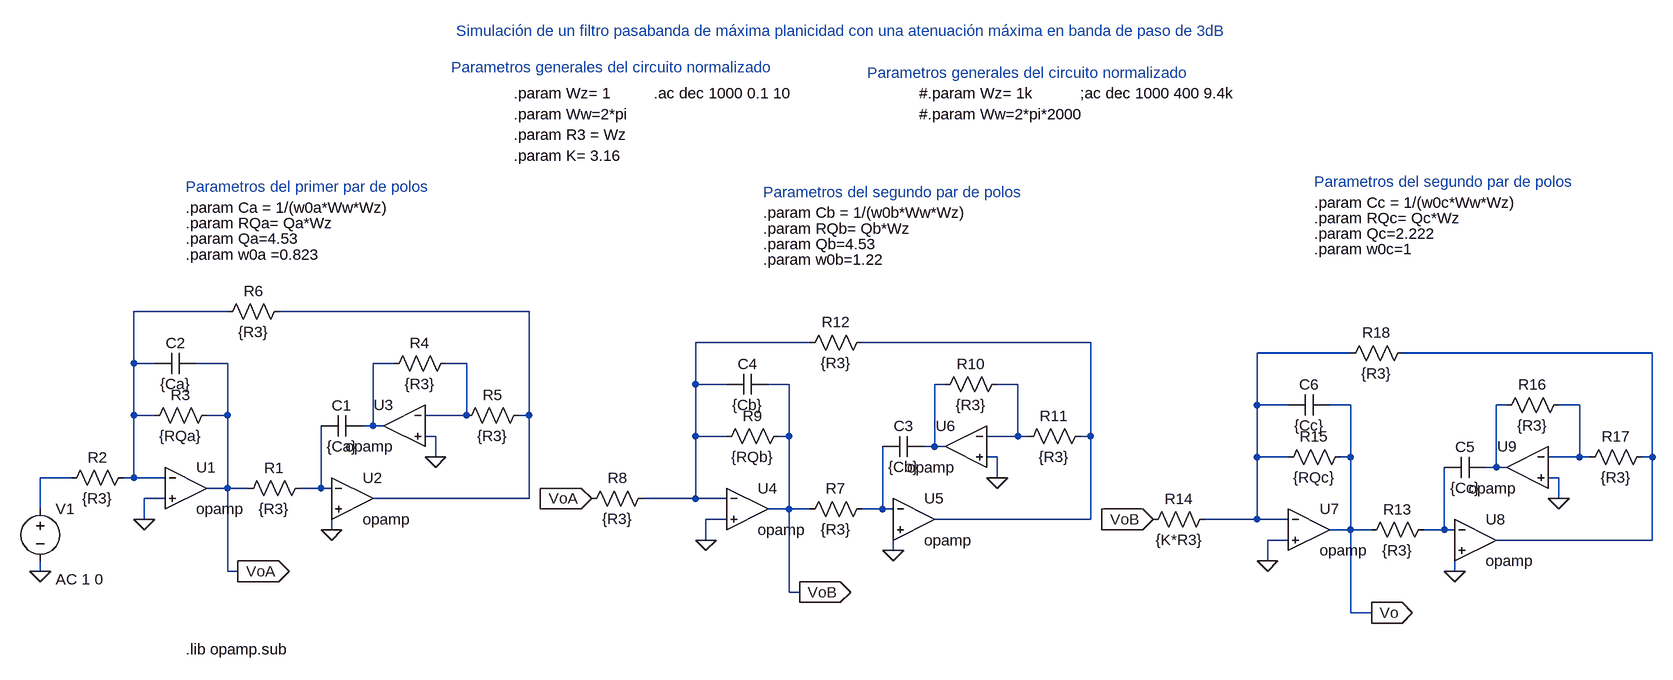
[diagram p0: schematic sim_ts4Bis.asc]
sim_ts4Bis.asc, the LTspice schematic file:
Version 4
SHEET 1 1736 856
WIRE -688 -128 -832 -128
WIRE -224 -128 -608 -128
WIRE 208 -80 32 -80
WIRE 640 -80 288 -80
WIRE 1040 -64 896 -64
WIRE 1504 -64 1120 -64
WIRE -832 -48 -832 -128
WIRE -800 -48 -832 -48
WIRE -688 -48 -736 -48
WIRE -432 -48 -464 -48
WIRE -320 -48 -352 -48
WIRE 32 -16 32 -80
WIRE 80 -16 32 -16
WIRE 176 -16 144 -16
WIRE 416 -16 400 -16
WIRE 528 -16 496 -16
WIRE 896 16 896 -64
WIRE 944 16 896 16
WIRE 1040 16 1008 16
WIRE 1280 16 1264 16
WIRE 1392 16 1360 16
WIRE -832 32 -832 -48
WIRE -800 32 -832 32
WIRE -688 32 -688 -48
WIRE -688 32 -720 32
WIRE -320 32 -320 -48
WIRE -320 32 -384 32
WIRE -224 32 -224 -128
WIRE -224 32 -240 32
WIRE -464 48 -464 -48
WIRE -464 48 -480 48
WIRE -448 48 -464 48
WIRE -368 64 -384 64
WIRE 32 64 32 -16
WIRE 80 64 32 64
WIRE 176 64 176 -16
WIRE 176 64 160 64
WIRE 528 64 528 -16
WIRE 528 64 480 64
WIRE 544 64 528 64
WIRE 640 64 640 -80
WIRE 640 64 624 64
WIRE 400 80 400 -16
WIRE 400 80 384 80
WIRE 416 80 400 80
WIRE -368 96 -368 64
WIRE 496 96 480 96
WIRE 896 96 896 16
WIRE 944 96 896 96
WIRE 1040 96 1040 16
WIRE 1040 96 1024 96
WIRE 1392 96 1392 16
WIRE 1392 96 1344 96
WIRE 1408 96 1392 96
WIRE 1504 96 1504 -64
WIRE 1504 96 1488 96
WIRE 1264 112 1264 16
WIRE 1264 112 1248 112
WIRE 1280 112 1264 112
WIRE -928 128 -976 128
WIRE -832 128 -832 32
WIRE -832 128 -848 128
WIRE -784 128 -832 128
WIRE 496 128 496 96
WIRE 1360 128 1344 128
WIRE -688 144 -688 32
WIRE -688 144 -720 144
WIRE -656 144 -688 144
WIRE -544 144 -544 48
WIRE -544 144 -576 144
WIRE -528 144 -544 144
WIRE -784 160 -816 160
WIRE -224 160 -224 32
WIRE -224 160 -464 160
WIRE 32 160 32 64
WIRE 32 160 -48 160
WIRE 80 160 32 160
WIRE 1360 160 1360 128
WIRE -976 176 -976 128
WIRE 176 176 176 64
WIRE 176 176 144 176
WIRE 208 176 176 176
WIRE 320 176 320 80
WIRE 320 176 288 176
WIRE 336 176 320 176
WIRE -816 192 -816 160
WIRE 80 192 48 192
WIRE 640 192 640 64
WIRE 640 192 400 192
WIRE 896 192 896 96
WIRE 896 192 816 192
WIRE 944 192 896 192
WIRE -528 208 -528 176
WIRE 1040 208 1040 96
WIRE 1040 208 1008 208
WIRE 1072 208 1040 208
WIRE 1184 208 1184 112
WIRE 1184 208 1152 208
WIRE 1200 208 1184 208
WIRE 48 224 48 192
WIRE 944 224 912 224
WIRE 1504 224 1504 96
WIRE 1504 224 1264 224
WIRE 336 240 336 208
WIRE 912 256 912 224
WIRE -976 272 -976 256
WIRE -688 272 -688 144
WIRE -672 272 -688 272
WIRE 1200 272 1200 240
WIRE 176 304 176 176
WIRE 192 304 176 304
WIRE 1040 336 1040 208
WIRE 1072 336 1040 336
FLAG -672 272 VoA
IOPIN -672 272 Out
FLAG -976 272 0
FLAG -816 192 0
FLAG -528 208 0
FLAG -368 96 0
FLAG 192 304 VoB
IOPIN 192 304 Out
FLAG 48 224 0
FLAG 336 240 0
FLAG 496 128 0
FLAG -128 160 VoA
IOPIN -128 160 In
FLAG 1072 336 Vo
IOPIN 1072 336 Out
FLAG 912 256 0
FLAG 1200 272 0
FLAG 1360 160 0
FLAG 736 192 VoB
IOPIN 736 192 In
SYMBOL OpAmps\\opamp -752 80 R0
SYMATTR InstName U1
SYMBOL OpAmps\\opamp -496 96 R0
SYMATTR InstName U2
SYMBOL OpAmps\\opamp -416 -16 M0
SYMATTR InstName U3
SYMBOL res -560 128 R90
WINDOW 0 0 56 VBottom 2
WINDOW 3 32 56 VTop 2
SYMATTR InstName R1
SYMATTR Value {R3}
SYMBOL res -832 112 R90
WINDOW 0 0 56 VBottom 2
WINDOW 3 32 56 VTop 2
SYMATTR InstName R2
SYMATTR Value {R3}
SYMBOL res -704 16 R90
WINDOW 0 0 56 VBottom 2
WINDOW 3 32 56 VTop 2
SYMATTR InstName R3
SYMATTR Value {RQa}
SYMBOL cap -480 32 R90
WINDOW 0 0 32 VBottom 2
WINDOW 3 32 32 VTop 2
SYMATTR InstName C1
SYMATTR Value {Ca}
SYMBOL res -336 -64 R90
WINDOW 0 0 56 VBottom 2
WINDOW 3 32 56 VTop 2
SYMATTR InstName R4
SYMATTR Value {R3}
SYMBOL res -224 16 R90
WINDOW 0 0 56 VBottom 2
WINDOW 3 32 56 VTop 2
SYMATTR InstName R5
SYMATTR Value {R3}
SYMBOL res -592 -144 R90
WINDOW 0 0 56 VBottom 2
WINDOW 3 32 56 VTop 2
SYMATTR InstName R6
SYMATTR Value {R3}
SYMBOL voltage -976 160 R0
WINDOW 123 24 124 Left 2
WINDOW 39 0 0 Left 2
SYMATTR Value2 AC 1 0
SYMATTR InstName V1
SYMATTR Value ""
SYMBOL cap -736 -64 R90
WINDOW 0 0 32 VBottom 2
WINDOW 3 32 32 VTop 2
SYMATTR InstName C2
SYMATTR Value {Ca}
SYMBOL OpAmps\\opamp 112 112 R0
SYMATTR InstName U4
SYMBOL OpAmps\\opamp 368 128 R0
SYMATTR InstName U5
SYMBOL OpAmps\\opamp 448 16 M0
SYMATTR InstName U6
SYMBOL res 304 160 R90
WINDOW 0 0 56 VBottom 2
WINDOW 3 32 56 VTop 2
SYMATTR InstName R7
SYMATTR Value {R3}
SYMBOL res -32 144 R90
WINDOW 0 0 56 VBottom 2
WINDOW 3 32 56 VTop 2
SYMATTR InstName R8
SYMATTR Value {R3}
SYMBOL res 176 48 R90
WINDOW 0 0 56 VBottom 2
WINDOW 3 32 56 VTop 2
SYMATTR InstName R9
SYMATTR Value {RQb}
SYMBOL cap 384 64 R90
WINDOW 0 0 32 VBottom 2
WINDOW 3 32 32 VTop 2
SYMATTR InstName C3
SYMATTR Value {Cb}
SYMBOL res 512 -32 R90
WINDOW 0 0 56 VBottom 2
WINDOW 3 32 56 VTop 2
SYMATTR InstName R10
SYMATTR Value {R3}
SYMBOL res 640 48 R90
WINDOW 0 0 56 VBottom 2
WINDOW 3 32 56 VTop 2
SYMATTR InstName R11
SYMATTR Value {R3}
SYMBOL res 304 -96 R90
WINDOW 0 0 56 VBottom 2
WINDOW 3 32 56 VTop 2
SYMATTR InstName R12
SYMATTR Value {R3}
SYMBOL cap 144 -32 R90
WINDOW 0 0 32 VBottom 2
WINDOW 3 32 32 VTop 2
SYMATTR InstName C4
SYMATTR Value {Cb}
SYMBOL OpAmps\\opamp 976 144 R0
SYMATTR InstName U7
SYMBOL OpAmps\\opamp 1232 160 R0
SYMATTR InstName U8
SYMBOL OpAmps\\opamp 1312 48 M0
SYMATTR InstName U9
SYMBOL res 1168 192 R90
WINDOW 0 0 56 VBottom 2
WINDOW 3 32 56 VTop 2
SYMATTR InstName R13
SYMATTR Value {R3}
SYMBOL res 832 176 R90
WINDOW 0 0 56 VBottom 2
WINDOW 3 32 56 VTop 2
SYMATTR InstName R14
SYMATTR Value {K*R3}
SYMBOL res 1040 80 R90
WINDOW 0 0 56 VBottom 2
WINDOW 3 32 56 VTop 2
SYMATTR InstName R15
SYMATTR Value {RQc}
SYMBOL cap 1248 96 R90
WINDOW 0 0 32 VBottom 2
WINDOW 3 32 32 VTop 2
SYMATTR InstName C5
SYMATTR Value {Cc}
SYMBOL res 1376 0 R90
WINDOW 0 0 56 VBottom 2
WINDOW 3 32 56 VTop 2
SYMATTR InstName R16
SYMATTR Value {R3}
SYMBOL res 1504 80 R90
WINDOW 0 0 56 VBottom 2
WINDOW 3 32 56 VTop 2
SYMATTR InstName R17
SYMATTR Value {R3}
SYMBOL res 1136 -80 R90
WINDOW 0 0 56 VBottom 2
WINDOW 3 32 56 VTop 2
SYMATTR InstName R18
SYMATTR Value {R3}
SYMBOL cap 1008 0 R90
WINDOW 0 0 32 VBottom 2
WINDOW 3 32 32 VTop 2
SYMATTR InstName C6
SYMATTR Value {Cc}
TEXT -248 -400 Left 2 !.param R3 = Wz
TEXT -248 -464 Left 2 !.param Wz= 1
TEXT -248 -432 Left 2 !.param Ww=2*pi
TEXT -344 -504 Left 2 ;Parametros generales del circuito normalizado
TEXT -752 -320 Left 2 ;Parametros del primer par de polos
TEXT -752 -288 Left 2 !.param Ca = 1/(w0a*Ww*Wz)
TEXT -752 -264 Left 2 !.param RQa= Qa*Wz
TEXT -752 -240 Left 2 !.param Qa=4.53
TEXT -752 -216 Left 2 !.param w0a =0.823
TEXT 136 -312 Left 2 ;Parametros del segundo par de polos
TEXT 136 -280 Left 2 !.param Cb = 1/(w0b*Ww*Wz)
TEXT 136 -256 Left 2 !.param RQb= Qb*Wz
TEXT 136 -232 Left 2 !.param Qb=4.53
TEXT 136 -208 Left 2 !.param w0b=1.22
TEXT 984 -328 Left 2 ;Parametros del segundo par de polos
TEXT 984 -296 Left 2 !.param Cc = 1/(w0c*Ww*Wz)
TEXT 984 -272 Left 2 !.param RQc= Qc*Wz
TEXT 984 -248 Left 2 !.param Qc=2.222
TEXT 984 -224 Left 2 !.param w0c=1
TEXT -248 -368 Left 2 !.param K= 3.16
TEXT -32 -464 Left 2 !.ac dec 1000 0.1 10
TEXT -752 392 Left 2 !.lib opamp.sub
TEXT -336 -560 Left 2 ;Simulación de un filtro pasabanda de máxima planicidad con una atenuación máxima en banda de paso de 3dB
TEXT 376 -464 Left 2 !#.param Wz= 1k
TEXT 376 -432 Left 2 !#.param Ww=2*pi*2000
TEXT 296 -496 Left 2 ;Parametros generales del circuito normalizado
TEXT 624 -464 Left 2 !;ac dec 1000 400 9.4k

The netlist it stands for:
* sim_ts4Bis.asc
XU1 N001 0 VoA opamp Aol=100K GBW=10Meg  ; pins invin noninvin out
XU2 N014 0 N002 opamp Aol=100K GBW=10Meg  ; pins invin noninvin out
XU3 N008 0 N007 opamp Aol=100K GBW=10Meg  ; pins invin noninvin out
R1 N014 VoA {R3}
R2 N001 N013 {R3}
R3 VoA N001 {RQa}
C1 N007 N014 {Ca}
R4 N008 N007 {R3}
R5 N002 N008 {R3}
R6 N002 N001 {R3}
V1 N013 0 AC 1 0
C2 VoA N001 {Ca}
XU4 N003 0 VoB opamp Aol=100K GBW=10Meg  ; pins invin noninvin out
XU5 N015 0 N004 opamp Aol=100K GBW=10Meg  ; pins invin noninvin out
XU6 N010 0 N009 opamp Aol=100K GBW=10Meg  ; pins invin noninvin out
R7 N015 VoB {R3}
R8 N003 VoA {R3}
R9 VoB N003 {RQb}
C3 N009 N015 {Cb}
R10 N010 N009 {R3}
R11 N004 N010 {R3}
R12 N004 N003 {R3}
C4 VoB N003 {Cb}
XU7 N005 0 Vo opamp Aol=100K GBW=10Meg  ; pins invin noninvin out
XU8 N016 0 N006 opamp Aol=100K GBW=10Meg  ; pins invin noninvin out
XU9 N012 0 N011 opamp Aol=100K GBW=10Meg  ; pins invin noninvin out
R13 N016 Vo {R3}
R14 N005 VoB {K*R3}
R15 Vo N005 {RQc}
C5 N011 N016 {Cc}
R16 N012 N011 {R3}
R17 N006 N012 {R3}
R18 N006 N005 {R3}
C6 Vo N005 {Cc}
.param R3 = Wz
.param Wz= 1
.param Ww=2*pi
* Parametros generales del circuito normalizado
* Parametros del primer par de polos
.param Ca = 1/(w0a*Ww*Wz)
.param RQa= Qa*Wz
.param Qa=4.53
.param w0a =0.823
* Parametros del segundo par de polos
.param Cb = 1/(w0b*Ww*Wz)
.param RQb= Qb*Wz
.param Qb=4.53
.param w0b=1.22
* Parametros del segundo par de polos
.param Cc = 1/(w0c*Ww*Wz)
.param RQc= Qc*Wz
.param Qc=2.222
.param w0c=1
.param K= 3.16
.ac dec 1000 0.1 10
.lib opamp.sub
* Simulación de un filtro pasabanda de máxima planicidad con una atenuación máxima en banda de paso de 3dB
#.param Wz= 1k
#.param Ww=2*pi*2000
* Parametros generales del circuito normalizado
;ac dec 1000 400 9.4k
.backanno
.end